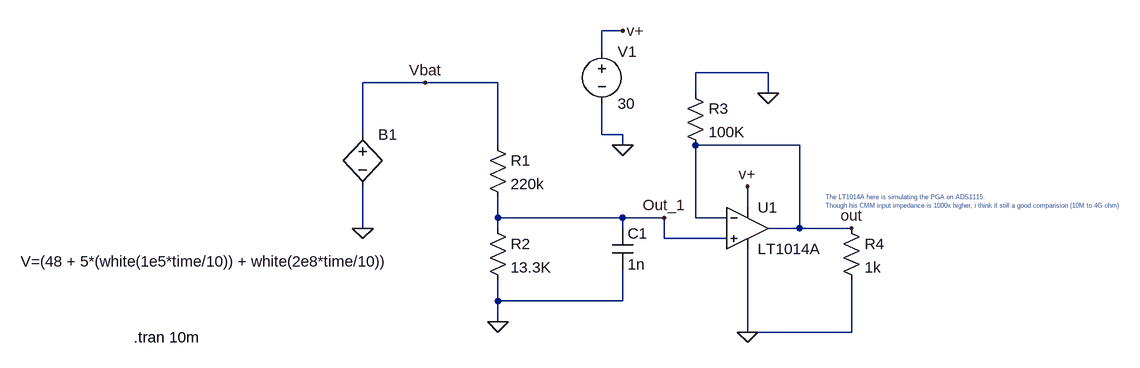
[diagram p0: schematic BatBank_Vin_simulations v0.asc]
BatBank_Vin_simulations v0.asc, the LTspice schematic file:
Version 4
SHEET 1 1068 680
WIRE 256 -96 224 -96
WIRE 224 -64 224 -96
WIRE 480 -32 368 -32
WIRE -48 -16 -144 -16
WIRE 64 -16 -48 -16
WIRE 368 0 368 -32
WIRE 480 0 480 -32
WIRE -144 64 -144 -16
WIRE 224 64 224 16
WIRE 256 64 224 64
WIRE 64 80 64 -16
WIRE 256 80 256 64
WIRE 528 80 368 80
WIRE 448 176 448 144
WIRE 64 192 64 160
WIRE 256 192 64 192
WIRE 320 192 256 192
WIRE 368 192 368 80
WIRE 416 192 368 192
WIRE -144 208 -144 144
WIRE 64 208 64 192
WIRE 256 208 256 192
WIRE 528 208 528 80
WIRE 528 208 480 208
WIRE 608 208 528 208
WIRE 320 224 320 192
WIRE 416 224 320 224
WIRE 64 320 64 288
WIRE 256 320 256 272
WIRE 256 320 64 320
WIRE 64 352 64 320
WIRE 448 368 448 240
WIRE 608 368 608 288
WIRE 608 368 448 368
FLAG 64 352 0
FLAG -48 -16 Vbat
FLAG -144 208 0
FLAG 320 192 Out_1
FLAG 256 80 0
FLAG 256 -96 v+
FLAG 448 144 v+
FLAG 448 368 0
FLAG 608 208 out
FLAG 480 0 0
SYMBOL res 48 64 R0
SYMATTR InstName R1
SYMATTR Value 220k
SYMATTR SpiceLine tol=1 pwr=0.1
SYMBOL res 48 192 R0
SYMATTR InstName R2
SYMATTR Value 13.3K
SYMATTR SpiceLine tol=1 pwr=0.1
SYMBOL bv -144 48 R0
WINDOW 3 -526 211 Left 2
SYMATTR Value V=(48 + 5*(white(1e5*time/10)) + white(2e8*time/10))
SYMATTR InstName B1
SYMBOL cap 240 208 R0
SYMATTR InstName C1
SYMATTR Value 1n
SYMATTR SpiceLine V=100 Irms=940m Rser=0.0607607 Lser=0
SYMBOL voltage 224 -80 R0
WINDOW 123 0 0 Left 0
WINDOW 39 0 0 Left 0
SYMATTR InstName V1
SYMATTR Value 30
SYMBOL res 352 -16 R0
SYMATTR InstName R3
SYMATTR Value 100K
SYMBOL Opamps\\LT1014A 448 144 R0
SYMATTR InstName U1
SYMBOL res 592 192 R0
SYMATTR InstName R4
SYMATTR Value 1k
TEXT -496 376 Left 2 !.tran 10m
TEXT 568 160 Left 0 ;The LT1014A here is simulating the PGA on ADS1115.\nThough his CMM input impedance is 1000x higher, i think it still a good comparision (10M to 4G ohm)

The netlist it stands for:
* BatBank_Vin_simulations v0.asc
R1 Vbat Out_1 220k tol=1 pwr=0.1
R2 Out_1 0 13.3K tol=1 pwr=0.1
B1 Vbat 0 V=(48 + 5*(white(1e5*time/10)) + white(2e8*time/10))
C1 Out_1 0 1n V=100 Irms=940m Rser=0.0607607 Lser=0
V1 v+ 0 30
R3 0 out 100K
XU1 Out_1 out v+ 0 out LT1014A  ; pins In+ In- V+ V- OUT
R4 out 0 1k
.tran 10m
* The LT1014A here is simulating the PGA on ADS1115.
* Though his CMM input impedance is 1000x higher, i think it still a good comparision (10M to 4G ohm)
.backanno
.end